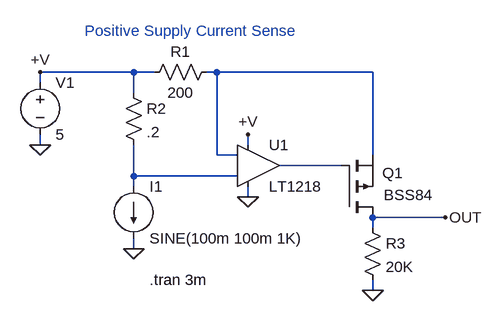
[diagram p0: schematic 1218.asc]
1218.asc, the LTspice schematic file:
Version 4
SHEET 1 896 680
WIRE 0 96 -144 96
WIRE 32 96 0 96
WIRE 128 96 112 96
WIRE 368 96 128 96
WIRE -144 112 -144 96
WIRE 0 128 0 96
WIRE -144 208 -144 192
WIRE 176 208 176 192
WIRE 128 224 128 96
WIRE 160 224 128 224
WIRE 368 224 368 96
WIRE 320 240 224 240
WIRE 0 256 0 208
WIRE 160 256 0 256
WIRE 0 272 0 256
WIRE 176 288 176 272
WIRE 480 320 368 320
WIRE 368 336 368 320
WIRE 0 368 0 352
WIRE 368 432 368 416
FLAG -144 208 0
FLAG 176 192 +V
FLAG -144 96 +V
FLAG 0 368 0
FLAG 176 288 0
FLAG 368 432 0
FLAG 480 320 OUT
SYMBOL voltage -144 96 R0
SYMATTR InstName V1
SYMATTR Value 5
SYMBOL res 128 80 R90
WINDOW 0 0 56 VBottom 2
WINDOW 3 32 56 VTop 2
SYMATTR InstName R1
SYMATTR Value 200
SYMBOL opamps\\LT1218 192 240 R0
SYMATTR InstName U1
SYMBOL pmos 320 320 M180
WINDOW 0 63 69 Left 2
WINDOW 3 65 35 Left 2
SYMATTR InstName Q1
SYMATTR Value BSS84
SYMBOL res -16 112 R0
SYMATTR InstName R2
SYMATTR Value .2
SYMBOL current 0 272 R0
WINDOW 123 0 0 Left 2
WINDOW 39 0 0 Left 2
SYMATTR InstName I1
SYMATTR Value SINE(100m 100m 1K)
SYMBOL res 352 320 R0
SYMATTR InstName R3
SYMATTR Value 20K
TEXT 24 416 Left 2 !.tran 3m
TEXT 88 48 Bottom 2 ;Positive Supply Current Sense

The netlist it stands for:
* 1218.asc
V1 +V 0 5
R1 N001 +V 200
XU1 N003 N001 +V 0 N002 NC_01 LT1218
M§Q1 OUT N002 N001 N001 BSS84
R2 +V N003 .2
I1 N003 0 SINE(100m 100m 1K)
R3 OUT 0 20K
.model NMOS NMOS
.model PMOS PMOS
.lib standard.mos
.tran 3m
* Positive Supply Current Sense
.lib LTC.lib
.backanno
.end